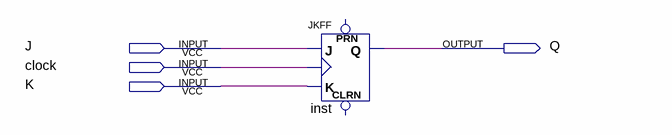
[diagram p0: schematic sheet]
// Quartus schematic Chapter5-1.bdf as structural Verilog: 1 symbols, 4 pins
module \Chapter5-1  (
  input  J,
  input  clock,
  input  K,
  output Q
);

  JKFF inst (.K(K), .J(J), .CLK(clock), .Q(Q));  // open: PRN, CLRN
endmodule
